# EAGLE schematic USB-C PURE v1 (EAGLE 9.7.0)
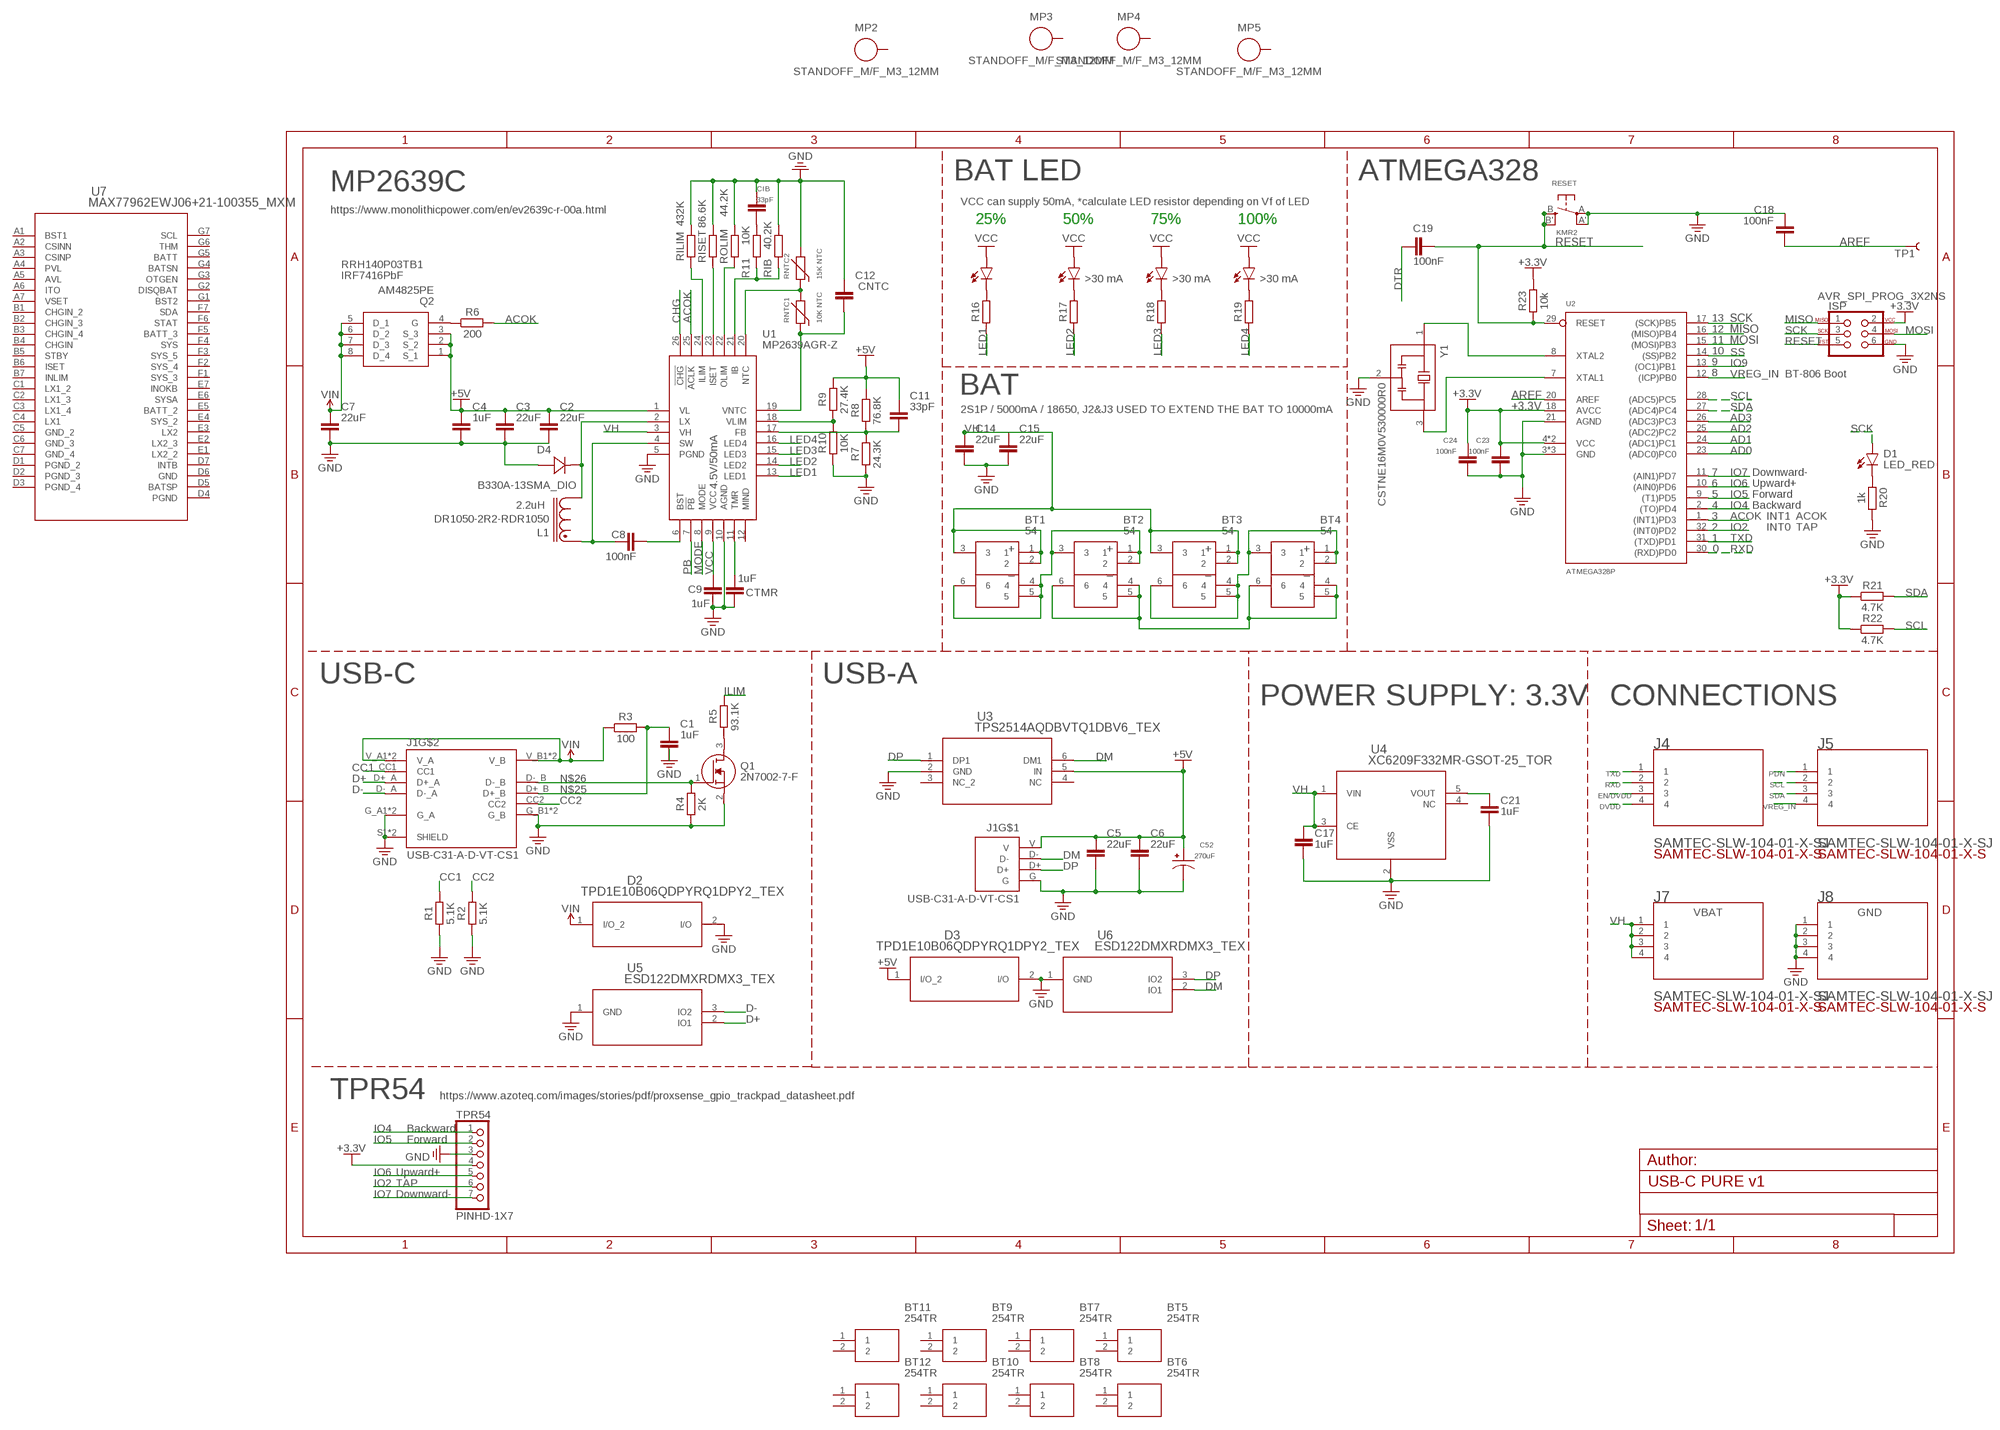
[diagram p0: schematic, sheet 1]

## Parts
BT1  54  [54]
BT2  54  [54]
BT3  54  [54]
BT4  54  [54]
BT5  254TR  [254TR]
BT6  254TR  [254TR]
BT7  254TR  [254TR]
BT8  254TR  [254TR]
BT9  254TR  [254TR]
BT10  254TR  [254TR]
BT11  254TR  [254TR]
BT12  254TR  [254TR]
C1  1uF  C_CHIP-0805(2012-METRIC)  [CAPC2012X110]
C2  22uF  C_CHIP-0805(2012-METRIC)  [CAPC2012X110]
C3  22uF  C_CHIP-0805(2012-METRIC)  [CAPC2012X110]
C4  1uF  C_CHIP-0805(2012-METRIC)  [CAPC2012X110]
C5  22uF  C_CHIP-0805(2012-METRIC)  [CAPC2012X110]
C6  22uF  C_CHIP-0805(2012-METRIC)  [CAPC2012X110]
C7  22uF  C_CHIP-0805(2012-METRIC)  [CAPC2012X110]
C8  100nF  C_CHIP-0402(1005-METRIC)  [CAPC1005X60]
C9  1uF  C_CHIP-0805(2012-METRIC)  [CAPC2012X110]
C11  33pF  C_CHIP-0402(1005-METRIC)  [CAPC1005X60]
C12  CNTC  C_CHIP-0402(1005-METRIC)  [CAPC1005X60]
C14  22uF  C_CHIP-0805(2012-METRIC)  [CAPC2012X110]
C15  22uF  C_CHIP-0805(2012-METRIC)  [CAPC2012X110]
C17  1uF  C_CHIP-0805(2012-METRIC)  [CAPC2012X110]
C18  100nF  C_CHIP-0402(1005-METRIC)  [CAPC1005X60]
C19  100nF  C_CHIP-0402(1005-METRIC)  [CAPC1005X60]
C21  1uF  C_CHIP-0805(2012-METRIC)  [CAPC2012X110]
C23  100nF  C_CHIP-0402(1005-METRIC)  [CAPC1005X60]
C24  100nF  C_CHIP-0402(1005-METRIC)  [CAPC1005X60]
C52  270uF  16SVPG270M  [CAP_16SVPG270M]
CIB  33pF  C_CHIP-0402(1005-METRIC)  [CAPC1005X60]
CTMR  1uF  C_CHIP-0805(2012-METRIC)  [CAPC2012X110]
D1  LED_RED  CHIP-ROUND-R_0805  [LEDC2012X105N_RND-R]
D2  TPD1E10B06QDPYRQ1DPY2_TEX  [DPY2_TEX]
D3  TPD1E10B06QDPYRQ1DPY2_TEX  [DPY2_TEX]
D4  B330A-13SMA_DIO  [SMA_DIO]
ISP  AVR_SPI_PROG_3X2NS  [2X3-NS]
J1  USB-C31-A-D-VT-CS1  [ADAMTECH_USB-C31-A-D-VT-CS1]
J4  SAMTEC-SLW-104-01-X-SJ  [SAMTEC-SLW-104-01-X-S]
J5  SAMTEC-SLW-104-01-X-SJ  [SAMTEC-SLW-104-01-X-S]
J7  SAMTEC-SLW-104-01-X-SJ  [SAMTEC-SLW-104-01-X-S]
J8  SAMTEC-SLW-104-01-X-SJ  [SAMTEC-SLW-104-01-X-S]
L1  DR1050-2R2-RDR1050  [DR1050]
LED1  AA2810  [AA2810]
LED2  EAPL3809WA1  [EAPL3809WA1]
LED3  EAPL3809WA1  [EAPL3809WA1]
LED4  EAPL3809WA1  [EAPL3809WA1]
MP2  STANDOFF_M/F_M3_12MM  [STANDOFF_HEX_MALE-FEMALE_550X1200_M3X0.5_MTGP850H320]
MP3  STANDOFF_M/F_M3_12MM  [STANDOFF_HEX_MALE-FEMALE_550X1200_M3X0.5_MTGP850H320]
MP4  STANDOFF_M/F_M3_12MM  [STANDOFF_HEX_MALE-FEMALE_550X1200_M3X0.5_MTGP850H320]
MP5  STANDOFF_M/F_M3_12MM  [STANDOFF_HEX_MALE-FEMALE_550X1200_M3X0.5_MTGP850H320]
Q1  2N7002-7-F  [SOT96P240X120-3N]
Q2  AM4825PE  [SOIC127P600X175-8N]
R1  5.1K  R_CHIP-0402(1005-METRIC)  [RESC1005X40]
R2  5.1K  R_CHIP-0402(1005-METRIC)  [RESC1005X40]
R3  100  R_CHIP-0402(1005-METRIC)  [RESC1005X40]
R4  2K  R_CHIP-0402(1005-METRIC)  [RESC1005X40]
R5  93.1K  R_CHIP-0402(1005-METRIC)  [RESC1005X40]
R6  200  R_CHIP-0402(1005-METRIC)  [RESC1005X40]
R7  24.3K  R_CHIP-0402(1005-METRIC)  [RESC1005X40]
R8  76.8K  R_CHIP-0402(1005-METRIC)  [RESC1005X40]
R9  27.4K  R_CHIP-0402(1005-METRIC)  [RESC1005X40]
R10  10K  R_CHIP-0402(1005-METRIC)  [RESC1005X40]
R11  10K  R_CHIP-0402(1005-METRIC)  [RESC1005X40]
R16  R_CHIP-0402(1005-METRIC)  [RESC1005X40]
R17  R_CHIP-0402(1005-METRIC)  [RESC1005X40]
R18  R_CHIP-0402(1005-METRIC)  [RESC1005X40]
R19  R_CHIP-0402(1005-METRIC)  [RESC1005X40]
R20  1k  R_CHIP-0402(1005-METRIC)  [RESC1005X40]
R21  4.7K  R_CHIP-0402(1005-METRIC)  [RESC1005X40]
R22  4.7K  R_CHIP-0402(1005-METRIC)  [RESC1005X40]
R23  10k  R_CHIP-0402(1005-METRIC)  [RESC1005X40]
RESET  KMR2  SWITCH_TACT_SMT4.6X2.8  [BTN_KMR2_4.6X2.8]
RIB  40.2K  R_CHIP-0402(1005-METRIC)  [RESC1005X40]
RILIM  432K  R_CHIP-0402(1005-METRIC)  [RESC1005X40]
RISET  86.6K  R_CHIP-0402(1005-METRIC)  [RESC1005X40]
RNTC1  10K NTC  NCP18_CHIP-0603(1608-METRIC)  [THRMC1608X60N]
RNTC2  15K NTC  NCP18_CHIP-0603(1608-METRIC)  [THRMC1608X60N]
ROLIM  44.2K  R_CHIP-0402(1005-METRIC)  [RESC1005X40]
TP1  TEST-POINT3  [PAD.03X.03]
TPR54  PINHD-1X7  [1X07]
U1  MP2639AGR-Z  [MP2639AGRZ]
U2  ATMEGA328P  [MLF32-TH]
U3  TPS2514AQDBVTQ1DBV6_TEX  [DBV6_TEX]
U4  XC6209F332MR-GSOT-25_TOR  [SOT-25_TOR]
U5  ESD122DMXRDMX3_TEX  [DMX3_TEX]
U6  ESD122DMXRDMX3_TEX  [DMX3_TEX]
U7  MAX77962EWJ06+21-100355_MXM  [21-100355_MXM]
Y1  CSTNE16M0V530000R0  [OSC_CSTNE16M0V530000R0]

## Nets
+3.3V [usbvcc]: C23.1 C24.1 ISP.2 R21.1 R22.1 R23.2 TPR54.4 U2.4(VCC) U2.6(VCC) U2.18(AVCC)
+5V: C2.1 C3.1 C4.1 C5.1 C6.1 C11.1 C52.1 D3.1(I/O_2) J1.V Q2.1(S_1) Q2.2(S_2) Q2.3(S_3) R8.2 R9.2 U1.1(VL) U3.5(IN)
ACOK: R6.2 U1.25(!ACLK) U2.1((INT1)PD3)
AD0: U2.23((ADC0)PC0)
AD1: U2.24((ADC1)PC1)
AD2: U2.25((ADC2)PC2)
AD3: U2.26((ADC3)PC3)
AREF [aref]: C18.2 TP1.P$1 U2.20(AREF)
CC1: J1.CC1 R1.2
CC2: J1.CC2 R2.2
CHG: U1.26(!CHG)
D+: J1.D+_A U5.2(IO1)
D-: J1.D-_A U5.3(IO2)
DM: J1.D- U3.6(DM1) U6.2(IO1)
DP: J1.D+ U3.1(DP1) U6.3(IO2)
DTR: C19.1
DVDD: J4.4
EN/DVDD: J4.3
GND: C1.2 C2.2 C3.2 C4.2 C5.2 C6.2 C7.2 C9.2 C12.1 C14.2 C15.2 C17.2 C18.1 C21.2 C23.2 C24.2 C52.2 CIB.1 CTMR.1 D2.2(I/O) D3.2(I/O) D4.2 ISP.6 J1.G J1.G_A1(G_A) J1.G_A2(G_A) J1.G_B1(G_B) J1.G_B2(G_B) J1.S1(SHIELD) J1.S2(SHIELD) J8.1 J8.2 J8.3 J8.4 Q1.2(S) R1.1 R2.1 R4.1 R7.1 R10.1 R20.2 RESET.A'(P1) RESET.A(P) RIB.2 RILIM.2 RISET.2 RNTC2.2 ROLIM.2 TPR54.3 U1.5(PGND) U1.10(AGND) U2.3(GND) U2.5(GND) U2.21(AGND) U2.TH(GND) U3.2(GND) U4.2(VSS) U5.1(GND) U6.1(GND) Y1.2(GND)
ILIM: R5.2
IO2: TPR54.6 U2.32((INT0)PD2)
IO4: TPR54.1 U2.2((TO)PD4)
IO5: TPR54.2 U2.9((T1)PD5)
IO6: TPR54.5 U2.10((AIN0)PD6)
IO7: TPR54.7 U2.11((AIN1)PD7)
IO9: U2.13((OC1)PB1)
LED1: R16.1 U1.13(LED1)
LED2: R17.1 U1.14(LED2)
LED3: R18.1 U1.15(LED3)
LED4: R19.1 U1.16(LED4)
MISO: ISP.1 U2.16((MISO)PB4)
MODE: U1.8(MODE)
MOSI: ISP.4 U2.15((MOSI)PB3)
N$1: Q2.4(G) R6.1
N$2: BT1.4 BT1.5 BT1.6 BT2.1 BT2.2 BT2.3
N$3: Q1.3(D) R5.1
N$4: BT3.4 BT3.5 BT3.6 BT4.1 BT4.2 BT4.3
N$5: LED2.-(C) R17.2
N$6: LED1.-(C) R16.2
N$7: C8.1 L1.1 U1.4(SW)
N$8: D4.1 L1.2 U1.2(LX)
N$9: C8.2 U1.6(BST)
N$10: CTMR.2 U1.11(TMR)
N$11: C11.2 R7.2 R8.1 U1.17(FB)
N$12: R9.1 R10.2 U1.18(VLIM)
N$13: RNTC1.2 RNTC2.1 U1.20(NTC)
N$14: C12.2 RNTC1.1 U1.19(VNTC)
N$15: RILIM.1 U1.24(ILIM)
N$16: RISET.1 U1.23(ISET)
N$17: ROLIM.1 U1.22(OLIM)
N$18: CIB.2 R11.2
N$19: R11.1 RIB.1 U1.21(IB)
N$20: LED3.-(C) R18.2
N$21: LED4.-(C) R19.2
N$22: D1.C R20.1
N$23: BT2.4 BT2.5 BT2.6 BT4.4 BT4.5 BT4.6
N$24: C21.1 U4.5(VOUT)
N$25: C1.1 J1.D+_B R3.2
N$26: J1.D-_B Q1.1(G) R4.2
PB: U1.7(!PB)
PDN: J5.1
RESET: C19.2 ISP.5 R23.1 RESET.B'(S1) RESET.B(S) U2.29(RESET)
RXD: J4.2 U2.30((RXD)PD0)
SCK: D1.A ISP.3 U2.17((SCK)PB5)
SCL: J5.2 R22.2 U2.28((ADC5)PC5)
SDA: J5.3 R21.2 U2.27((ADC4)PC4)
SS: U2.14((SS)PB2)
TXD: J4.1 U2.31((TXD)PD1)
VCC: C9.1 LED1.+(A) LED2.+(A) LED3.+(A) LED4.+(A) U1.9(VCC)
VH: BT1.1 BT1.2 BT1.3 BT3.1 BT3.2 BT3.3 C14.1 C15.1 C17.1 J7.1 J7.2 J7.3 J7.4 U1.3(VH) U4.1(VIN) U4.3(CE)
VIN: C7.1 D2.1(I/O_2) J1.V_A1(V_A) J1.V_A2(V_A) J1.V_B1(V_B) J1.V_B2(V_B) Q2.5(D_1) Q2.6(D_2) Q2.7(D_3) Q2.8(D_4) R3.1
VREG_IN: J5.4 U2.12((ICP)PB0)
XTAL1: U2.7(XTAL1) Y1.3(OUT)
XTAL2: U2.8(XTAL2) Y1.1(IN)
Unconnected: BT5.1 BT5.2 BT6.1 BT6.2 BT7.1 BT7.2 BT8.1 BT8.2 BT9.1 BT9.2 BT10.1 BT10.2 BT11.1 BT11.2 BT12.1 BT12.2 MP2.1 MP3.1 MP4.1 MP5.1 U1.12(MIND) U3.3(NC_2) U3.4(NC) U4.4(NC) U7.A1(BST1) U7.A2(CSINN) U7.A3(CSINP) U7.A4(PVL) U7.A5(AVL) U7.A6(ITO) U7.A7(VSET) U7.B1(CHGIN_2) U7.B2(CHGIN_3) U7.B3(CHGIN_4) U7.B4(CHGIN) U7.B5(STBY) U7.B6(ISET) U7.B7(INLIM) U7.C1(LX1_2) U7.C2(LX1_3) U7.C3(LX1_4) U7.C4(LX1) U7.D5(BATSP) U7.D7(INTB) U7.E1(LX2_2) U7.E2(LX2_3) U7.E3(LX2) U7.E4(SYS_2) U7.E5(BATT_2) U7.E6(SYSA) U7.E7(INOKB) U7.F1(SYS_3) U7.F2(SYS_4) U7.F3(SYS_5) U7.F4(SYS) U7.F5(BATT_3) U7.F6(STAT) U7.F7(SDA) U7.G1(BST2) U7.G2(DISQBAT) U7.G3(OTGEN) U7.G4(BATSN) U7.G5(BATT) U7.G6(THM) U7.G7(SCL)

## Notes on the sheet
- BAT LED | ATMEGA328
- MP2639C
- VCC can supply 50mA, *calculate LED resistor depending on Vf of LED
- https://www.monolithicpower.com/en/ev2639c-r-00a.html
- 25% | 50% | 75% | 100%
- RRH140P03TB1
- IRF7416PbF
- 13
- 12
- 11
- 10
- 9
- 8
- BT-806 Boot
- BAT
- 2S1P / 5000mA / 18650, J2&J3 USED TO EXTEND THE BAT TO 10000mA
- 7
- Downward-
- 6
- 4.5V/50mA | Upward+
- 5
- Forward
- 4
- 2.2uH | Backward
- 3 | INT1
- ACOK
- 2 | INT0
- TAP
- 1
- 0
- USB-C | USB-A
- POWER SUPPLY: 3.3V | CONNECTIONS
- VBAT | GND
- TPR54 | https://www.azoteq.com/images/stories/pdf/proxsense_gpio_trackpad_datasheet.pdf
- Backward
- Forward
- Upward+
- TAP
- Downward-

## Power pins joined to a net without a drawn wire
GND: U7.D6(GND)
GND_2: U7.C5(GND_2)
GND_3: U7.C6(GND_3)
GND_4: U7.C7(GND_4)
PGND: U7.D4(PGND)
PGND_2: U7.D1(PGND_2)
PGND_3: U7.D2(PGND_3)
PGND_4: U7.D3(PGND_4)

## Library data of the parts
BT1-BT4 = 54:54: Cylindrical Battery Contacts, Clips, Holders & Springs 16-19mm PC BATTERY CLIP Source: Datasheet <http://www.farnell.com/datasheets/1703960.pdf>; DESCRIPTION: Cylindrical Battery Contacts, Clips, Holders & Springs 16-19mm PC BATTERY CLIP; HEIGHT: mm; MANUFACTURER_NAME: Keystone Electronics; MANUFACTURER_PART_NUMBER: 54; MOUSER_PART_NUMBER: 534-54; MOUSER_PRICE-STOCK: https://www.mouser.co.uk/ProductDetail/Keystone-Electronics/54?qs=73q%2FgRcW4F3NakoJDesViw%3D%3D
BT5-BT12 = 254TR:254TR: Keystone Electronics BATTERY HOLDER ON TAPE AND REEL Source: Datasheet <https://www.keyelco.com/product-pdf.cfm?p=14420>; DESCRIPTION: Keystone Electronics BATTERY HOLDER ON TAPE AND REEL; HEIGHT: 16.97mm; MANUFACTURER_NAME: Keystone Electronics; MANUFACTURER_PART_NUMBER: 254TR; MOUSER_PART_NUMBER: 534-254TR; MOUSER_PRICE-STOCK: https://www.mouser.co.uk/ProductDetail/Keystone-Electronics/254TR?qs=u16ybLDytRapOGIb7D1Ytg%3D%3D
C1-C9 C11 C12 C14 C15 C17-C19 C21 C23 C24 CIB CTMR = Capacitor:C: Capacitor - Generic; CATEGORY: Capacitor
C52 = 16SVPG270M:16SVPG270M; MANUFACTURER: Panasonic; MAXIMUM_PACKAGE_HEIGHT: 9.9mm; PARTREV: 05-Mar-21; STANDARD: Manufacturer Recommendations
D1 = LED:CHIP-ROUND-R: LED - Generic; CATEGORY: LED; COLOR: RED; DESCRIPTION: CHIP LED ROUND; SUB-CATEGORY: CHIP; TYPE: ROUND_TOP
D2 D3 = TPD1E10B06QDPYRQ1:TPD1E10B06QDPYRQ1; COPYRIGHT: Copyright (C) 2022 Ultra Librarian. All rights reserved.; DIGI-KEY_PART_NUMBER_1: 296-45327-1-ND; DIGI-KEY_PART_NUMBER_2: 296-45327-2-ND; DIGI-KEY_PART_NUMBER_3: 296-45327-6-ND; DIGI-KEY_PART_NUMBER_4: 296-TPD1E10B06QDPYRQ1CT-ND; DIGI-KEY_PART_NUMBER_5: 296-TPD1E10B06QDPYRQ1DKR-ND; DIGI-KEY_PART_NUMBER_6: 296-TPD1E10B06QDPYRQ1TR-ND; MANUFACTURER_PART_NUMBER: TPD1E10B06QDPYRQ1; MFR_NAME: Texas Instruments
D4 = B330A-13:B330A-13; COPYRIGHT: Copyright (C) 2022 Ultra Librarian. All rights reserved.; MANUFACTURER_PART_NUMBER: B330A-13; MFR_NAME: Diodes Inc
ISP = SparkFun-Connectors:AVR_SPI_PROG_3X2: AVR ISP 6 Pin This is the reduced ISP connector for AVR programming. Common on Arduino. This footprint will take up less PCB space and can be used with a 10-pin to 6-pin adapter such as SKU: BOB-08508 **Special note about "TEST_POINT" package. The stop mask is on the top side, so if you want your programming test points to be on the bottom of your board, make sure to place this package on the bottom side of the board. This also ensure that the orientation to program from the bottom side will be correct. SparkFun Products: SparkFun ISP Pogo Adapter <https://www.sparkfun.com/products/11591> - NS Tiny AVR Programmer <https://www.sparkfun.com/products/11801> -PTH
J1 = USB-C31-A-D-VT-CS1:USB-C31-A-D-VT-CS1: USB-A (USB TYPE-A) and USB-C (USB TYPE-C), Stacked USB 2.0, USB 3.2 Gen 2 (USB 3.1 Gen 2, Superspeed+ (USB 3.1)) Receptacle Connector 28 Position Through Hole; DESCRIPTION: USB-A (USB TYPE-A) and USB-C (USB TYPE-C), Stacked USB 2.0, USB 3.2 Gen 2 (USB 3.1 Gen 2, Superspeed+ (USB 3.1)) Receptacle Connector 28 Position Through Hole; DIGI-KEY_PART_NUMBER: 2057-USB-C31-A-D-VT-CS1-ND; MF: Adam Tech; MP: USB-C31-A-D-VT-CS1; PACKAGE: None; PURCHASE-URL: https://pricing.snapeda.com/search/part/USB-C31-A-D-VT-CS1/?ref=eda
J4 J5 J7 J8 = SAMTEC-SLW-104-01-X-S:SAMTEC-SLW-104-01-X-S
L1 = DR1050-2R2-R:DR1050-2R2-R; COPYRIGHT: Copyright (C) 2022 Ultra Librarian. All rights reserved.; DIGI-KEY_PART_NUMBER_1: 513-1412-1-ND; DIGI-KEY_PART_NUMBER_2: 513-1412-2-ND; DIGI-KEY_PART_NUMBER_3: 513-1412-6-ND; MANUFACTURER_PART_NUMBER: DR1050-2R2-R; MFR_NAME: Eaton
LED1 = AA2810ASURSK:AA2810
LED2-LED4 = EAPL3809WA1:EAPL3809WA1
MP2-MP5 = PCB-Fasteners_Hardware:STANDOFF_M/F: Male-Male Standoff/Spacer with Mounting pad and hole. Essentra : Male-Female Standoff <https://www.essentracomponents.co.in/index.php?option=com_virtuemart&view=productdetails&virtuemart_product_id=14556> The hole and pad sizes may vary based on the application and type of hardware; always verify the Manufacturer specification or Global Standards.; CATEGORY: Standoff/Spacer; SUB-CATEGORY: Male-Female
Q1 = 2N7002-7-F:2N7002-7-F: MOSFET N-Channel 60V 0.21A SOT23 Diodes Inc 2N7002-7-F N-channel MOSFET Transistor, 0.115 A, 60 V, 3-Pin SOT-23 Source: Datasheet <https://datasheet.datasheetarchive.com/originals/distributors/SFDatasheet-0/sf-0003625.pdf>; ARROW_PART_NUMBER: 2N7002-7-F; ARROW_PRICE-STOCK: https://www.arrow.com/en/products/2n7002-7-f/diodes-incorporated?region=nac; DESCRIPTION: MOSFET N-Channel 60V 0.21A SOT23 Diodes Inc 2N7002-7-F N-channel MOSFET Transistor, 0.115 A, 60 V, 3-Pin SOT-23; HEIGHT: 1.2mm; MANUFACTURER_NAME: Diodes Inc.; MANUFACTURER_PART_NUMBER: 2N7002-7-F; MOUSER_PART_NUMBER: 621-2N7002-F; MOUSER_PRICE-STOCK: https://www.mouser.co.uk/ProductDetail/Diodes-Incorporated/2N7002-7-F?qs=jMXWnm70%252BC%252BAX%252BMLzUkTZg%3D%3D
Q2 = AM4825PE:AM4825PE: P-Channel 20-V (D-S) MOSFET Source: Datasheet <http://www.analogpowerinc.com/datasheet.php?data1=DS_AM4825PE>; DESCRIPTION: P-Channel 20-V (D-S) MOSFET; HEIGHT: 1.75mm; MANUFACTURER_NAME: Analog Power; MANUFACTURER_PART_NUMBER: AM4825PE
R1-R11 R16-R23 RIB RILIM RISET ROLIM = Resistor:R: Resistor Fixed - Generic; CATEGORY: Resistor; SUB-CATEGORY: Fixed
RESET = microbuilder:SWITCH_TACT_SMT: SMT Tact Switches 6x6mm - Digikey: P12940SCT-ND KMR2 (4.6x2.8mm) - Digikey: 401-1426-1-ND EVQ-PQHB55 - Light Touch, 160GF (4.5x4.5mm) - Digikey: P8090SCT-ND KMT0 - KMT021 NGJ LHS (etc.) IP68/Waterproof - Digikey: CKN10289CT-ND
RNTC1 RNTC2 = Sensor:NCP18*: NTC Thermistor 470k 0603; CATEGORY: Sensor; DESCRIPTION: THERM NTC 470KOHM 4500K 0603; MANUFACTURER: Murata Electronics; MPN: NCP18WM474J03RB; PART_STATUS: Active; SUB-CATEGORY: Temperature; VALUE: NCP18WM474
TP1 = SparkFun-Connectors:TEST-POINT: SparkFun Test Points Bare copper test points for troubleshooting or In-Circuit-Testing. These are used by our Production team for verifying production board runs using pogo-pins on test beds. SparkFun Products: SparkFun LSM9DS1 Breakout <https://www.sparkfun.com/products/13284> SparkFun PSOC <https://www.sparkfun.com/products/13714> SparkFun Load Cell Amplifier <https://www.sparkfun.com/products/13879>
TPR54 = Connector:PINHD-1X7: PIN HEADER; CATEGORY: CONNECTOR; SUB-CATEGORY: PIN-HEADER
U1 = MP2639AGR-Z:MP2639AGR-Z: Battery Management 2-Cell 2.5A Li-ion or Li-polymer Switching Charger Integrated Bidirectional Charge/Discharge Source: Datasheet <http://www.monolithicpower.com/pub/media/document/MP2639A_r1.0.pdf>; DESCRIPTION: Battery Management 2-Cell 2.5A Li-ion or Li-polymer Switching Charger Integrated Bidirectional Charge/Discharge; HEIGHT: 1mm; MANUFACTURER_NAME: Monolithic Power Systems (MPS); MANUFACTURER_PART_NUMBER: MP2639AGR-Z; MOUSER_PART_NUMBER: 946-MP2639AGR-Z; MOUSER_PRICE-STOCK: https://www.mouser.co.uk/ProductDetail/Monolithic-Power-Systems-MPS/MP2639AGR-Z?qs=YCa%2FAAYMW004W5DDRZSXeQ%3D%3D
U2 = microbuilder:ATMEGA328P: ATMEGA 328P
U3 = TPS2514AQDBVTQ1:TPS2514AQDBVTQ1; COPYRIGHT: Copyright (C) 2022 Ultra Librarian. All rights reserved.; DIGI-KEY_PART_NUMBER_1: 2156-TPS2514AQDBVTQ1-ND; DIGI-KEY_PART_NUMBER_2: 296-TPS2514AQDBVTQ1CT-ND; DIGI-KEY_PART_NUMBER_3: 296-TPS2514AQDBVTQ1DKR-ND; DIGI-KEY_PART_NUMBER_4: 296-TPS2514AQDBVTQ1TR-ND; DIGI-KEY_PART_NUMBER_5: TPS2514AQDBVTQ1-ND; MANUFACTURER_PART_NUMBER: TPS2514AQDBVTQ1; MFR_NAME: Texas Instruments
U4 = XC6209F332MR:XC6209F332MR-G; COPYRIGHT: Copyright (C) 2022 Ultra Librarian. All rights reserved.; DIGI-KEY_PART_NUMBER_1: 893-1070-1-ND; DIGI-KEY_PART_NUMBER_2: 893-1070-2-ND; DIGI-KEY_PART_NUMBER_3: 893-1070-6-ND; MANUFACTURER_PART_NUMBER: XC6209F332MR-G; MFR_NAME: Torex Semiconductor
U5 U6 = ESD122DMXR:ESD122DMXR; COPYRIGHT: Copyright (C) 2022 Ultra Librarian. All rights reserved.; DIGI-KEY_PART_NUMBER_1: 296-48543-1-ND; DIGI-KEY_PART_NUMBER_2: 296-48543-2-ND; DIGI-KEY_PART_NUMBER_3: 296-48543-6-ND; DIGI-KEY_PART_NUMBER_4: ESD122DMXR-ND; MANUFACTURER_PART_NUMBER: ESD122DMXR; MFR_NAME: Texas Instruments
U7 = MAX77962EWJ06:MAX77962EWJ06+; COPYRIGHT: Copyright (C) 2022 Ultra Librarian. All rights reserved.; MANUFACTURER_PART_NUMBER: MAX77962EWJ06+; MFR_NAME: Maxim Integrated Products
Y1 = CSTNE16M0V530000R0:CSTNE16M0V530000R0: 16MHz Ceramic Resonator Built in Capacitor 15pF ±0.15% 40 Ohms -40°C ~ 125°C Surface Mount; DESCRIPTION: 16 MHz Ceramic Resonator Built in Capacitor 15 pF ±0.3% 40 Ohms -40°C ~ 85°C Surface Mount; DIGI-KEY_PART_NUMBER: 490-17948-1-ND; MF: Murata Electronics; MP: CSTNE16M0V530000R0; PACKAGE: SMD-3 Murata; PURCHASE-URL: https://pricing.snapeda.com/search/part/CSTNE16M0V530000R0/?ref=eda

## Net classes
1 power: width 0.305 mm, drill 0.483 mm, clearance 0.203 mm
2 gnd: width 0.305 mm, drill 0.483 mm, clearance 0.203 mm
3 usbvcc: width 0.305 mm, drill 0.483 mm, clearance 0.203 mm
4 aref: width 0.254 mm, drill 0.483 mm, clearance 0.203 mm